# EAGLE schematic active_softstart_mig (EAGLE 6.5.0)
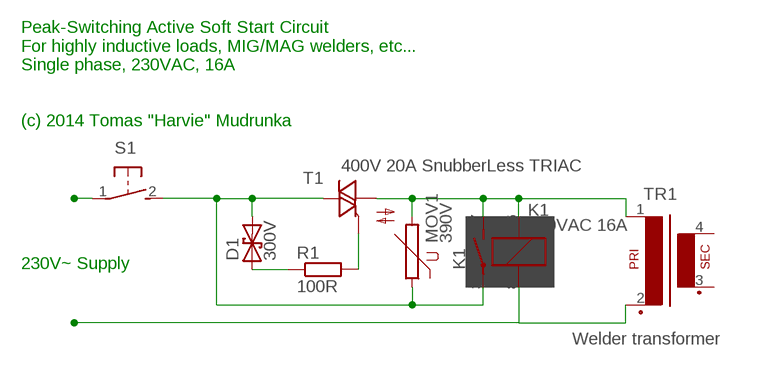
[diagram p0: schematic, sheet 1]

## Parts
D1  300V  P6KEXXC  [CB417-15]
K1  230VAC 16A  CB1A-P-12V  [CB1]
MOV1  390V  P592  [P592]
R1  100R  R-EU_0204/2V  [0204V]
S1  31-XX  [B3F-31XX]
T1  400V 20A SnubberLess TRIAC  BTA26-V  [TOP3S-1]
TR1  Welder transformer  VR2230-1  [VR22-1]

## Nets
N$1: K1.86 K1.87(2:S) MOV1.2 T1.A1 TR1.1
N$2: R1.2 T1.G
N$3: D1.A R1.1
N$4: D1.C K1.30(2:P) MOV1.1 S1.2(S) T1.A2
N$6: K1.85 TR1.2
N$9: S1.1(P)
Unconnected: TR1.3(S3) TR1.4(S4)

## Notes on the sheet
- Peak-Switching Active Soft Start Circuit
  For highly inductive loads, MIG/MAG welders, etc...
  Single phase, 230VAC, 16A
  
  
  (c) 2014 Tomas "Harvie" Mudrunka
- 230V~ Supply

## Library data of the parts
D1 = diode:P6KEXXC: DIODE transient-voltage suppressor
K1 = relay:CB*: HIGH POWER AUTOMOTIVE RELAY Form A NAiS Source: http://www.mew-europe.com/.. en_ds_61202_0000.pdf; MF: AROMAT/ MATSUSHITA; MPN: CB1A-P-12V; OC_FARNELL: 1270582; OC_NEWARK: 50B849
MOV1 = varistor:P592: VARISTOR
R1 = rcl:R-EU_: RESISTOR, European symbol
S1 = switch-omron:31-XX: OMRON SWITCH; MPN: B3F-3100; OC_FARNELL: 959704; OC_NEWARK: 36M3582
T1 = triac:BTA26: 25A TRIAC Source: http://www.st.com/stonline/products/literature/ds/7470.pdf
TR1 = trafo:VR2230-1: TRANSFORMER 1 primary winding, 1 secondary winding, mounting holes BLOCK